# EAGLE design GM-UART-V2 (EAGLE 9.3.0)
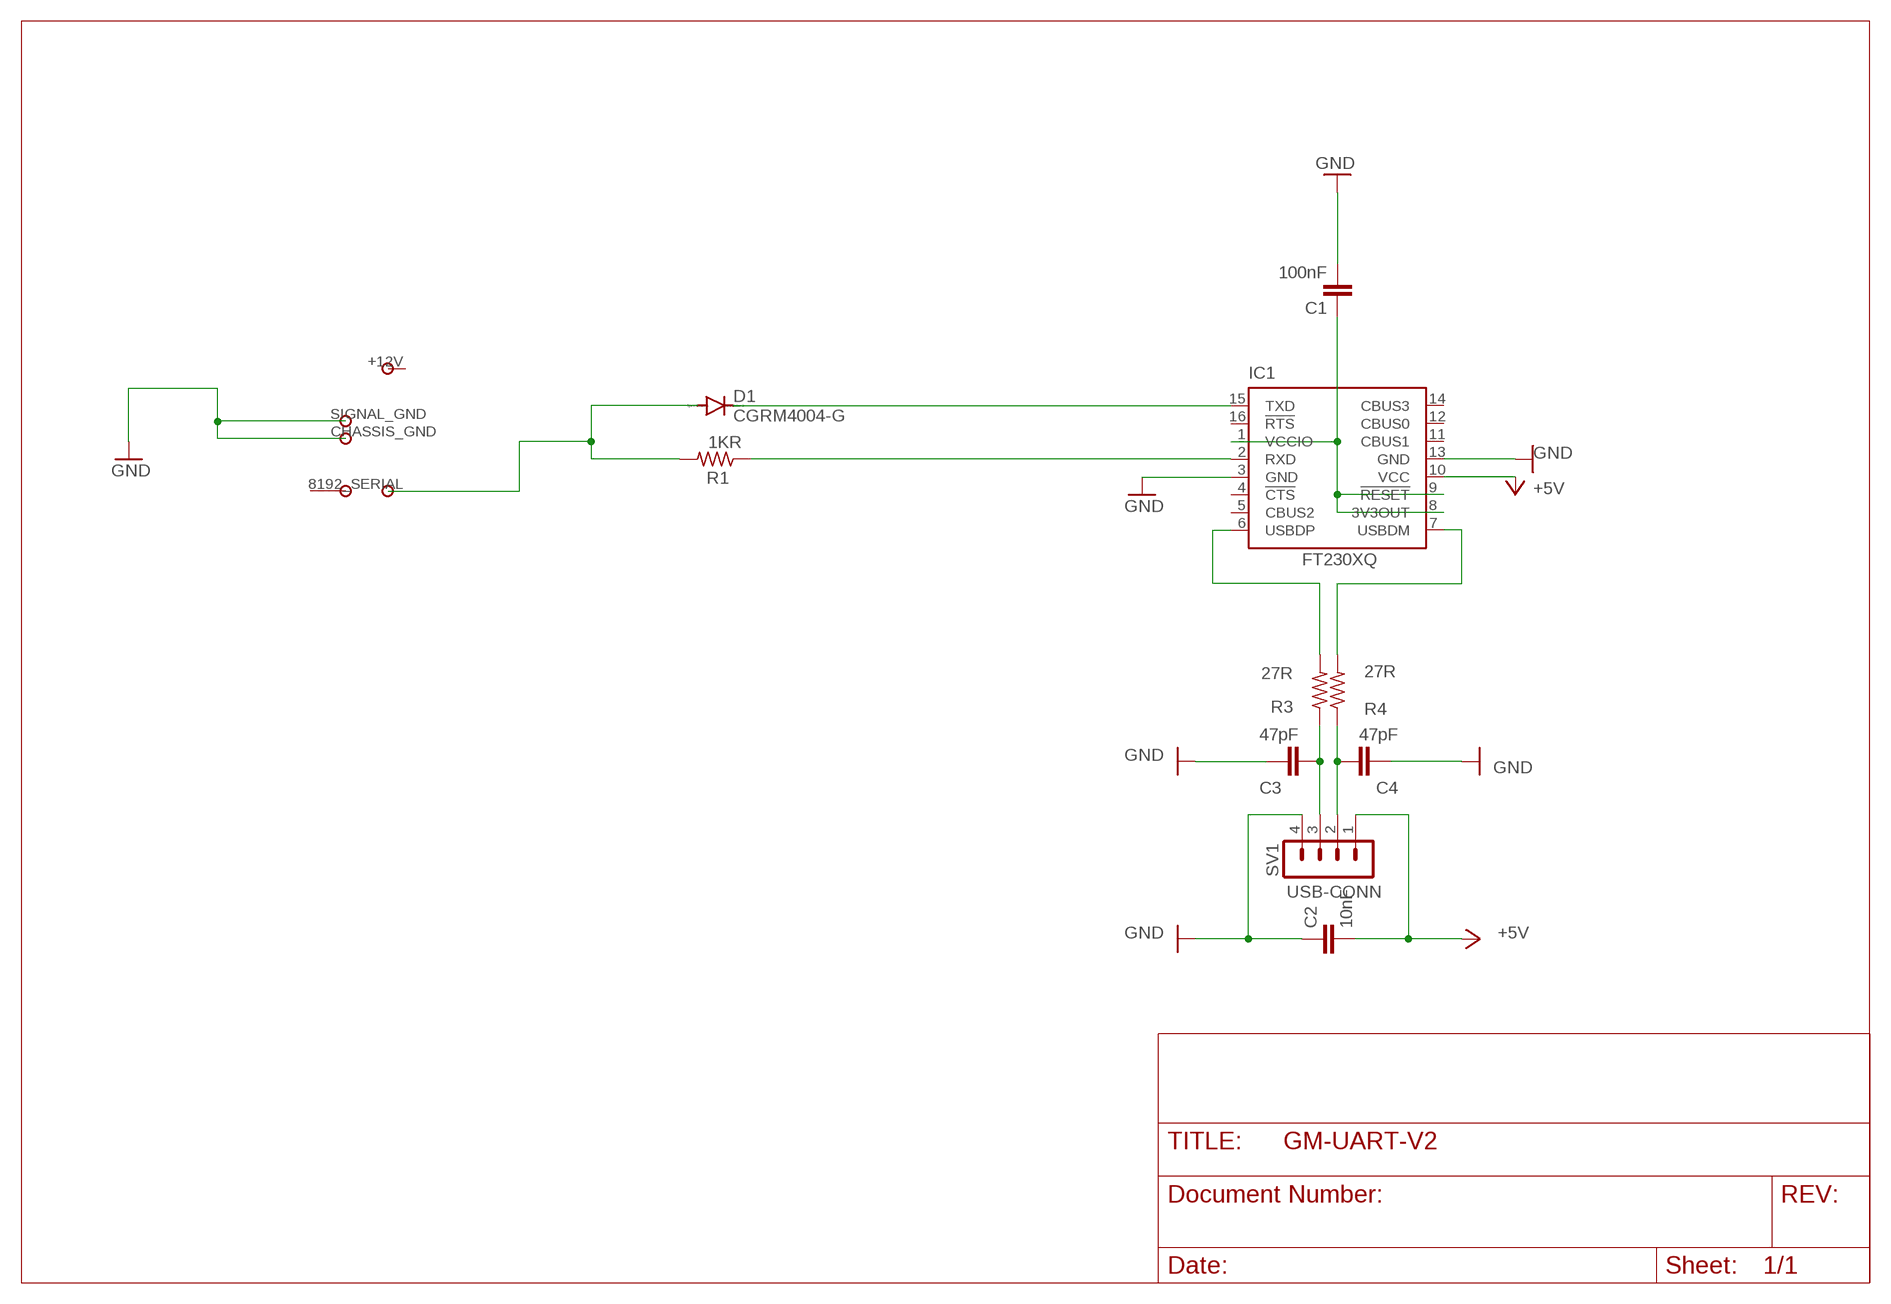
[diagram p0: schematic, sheet 1]

## Parts
C1  100nF  C-EUC0603K  [C0603K]
C2  10nF  C-EUC0603K  [C0603K]
C3  47pF  C-EUC0603K  [C0603K]
C4  47pF  C-EUC0603K  [C0603K]
D1  CGRM4004-G  [SOD-123_MINI-SMA]
IC1  FT230XQ  [QFN16]
R1  1KR  R-US_M0805  [M0805]
R3  27R  R-US_R0603  [R0603]
R4  27R  R-US_R0603  [R0603]
SV1  USB-CONN  MA04-1  [MA04-1]
U$2  OBD2PLUG  [OBD2PLUG]

## Nets
+5V: C2.2 IC1.10(VCC) SV1.1
GM-UART: D1.A R1.2 U$2.8192_SERIAL
GND: C1.2 C2.1 C3.2 C4.2 IC1.3(GND) IC1.13(GND) SV1.4 U$2.CHASSIS_GND U$2.SIGNAL_GND
N$1: C1.1 IC1.1(VCCIO) IC1.8(3V3OUT) IC1.9(!RESET)
N$2: C3.1 R3.1 SV1.3
N$3: C4.1 R4.1 SV1.2
N$4: IC1.7(USBDM) R4.2
N$5: IC1.6(USBDP) R3.2
RXD: IC1.2(RXD) R1.1
TXD: D1.C IC1.15(TXD)
Unconnected: IC1.4(!CTS) IC1.5(CBUS2) IC1.11(CBUS1) IC1.12(CBUS0) IC1.14(CBUS3) IC1.16(!RTS) U$2.P$1

## Power pins joined to a net without a drawn wire
+12V: U$2.+12V

## Library data of the parts
C1-C4 = rcl:C-EU: CAPACITOR, European symbol; SPICEPREFIX: C
D1 = diode:CGRM400*-G: Molded plasitc,JEDEC SOD-123/Mini SMA Source: Comchip CGRM4001-G.pdf
IC1 = ftdichip:FT230X: USB to BASIC UART IC Auto generated by make-symbol-device-package-bsdl.ulp Rev. 43 Source: Data sheet <http://www.ftdichip.com/Support/Documents/DataSheets/ICs/DS_FT230X.pdf>
R1 R3 R4 = rcl:R-US_: RESISTOR, American symbol; SPICEPREFIX: R
SV1 = con-lstb:MA04-1: PIN HEADER; OC_FARNELL: unknown; OC_NEWARK: unknown
U$2 = OBD2PLUG - Copy:OBD2PLUG

## Board
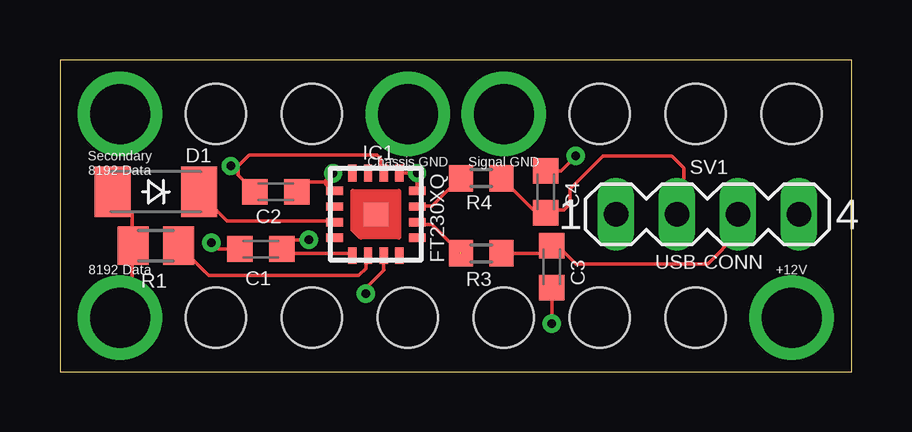
[diagram p1: board, top side]
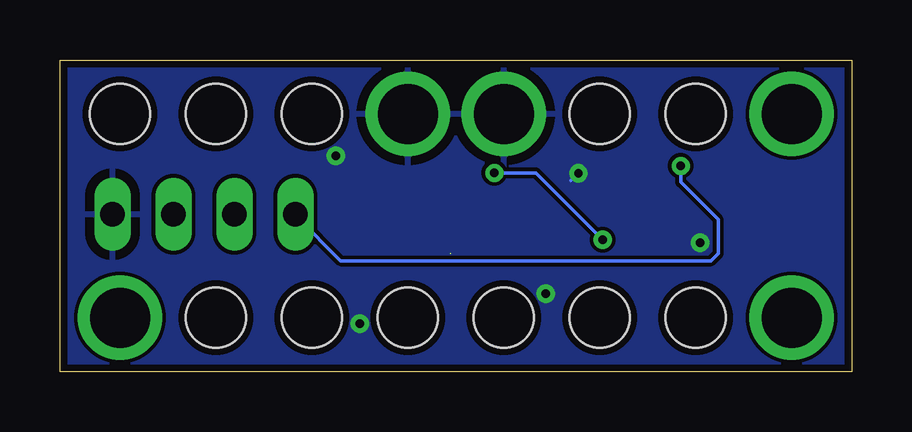
[diagram p2: board, bottom side, seen from below]

Size 33 x 13 mm. Coordinates in mm from the lower left corner, seen from the top.
Outline: 0,0 33,0 33,13 0,13 0,0
Copper layers (1*16): Top 0.035mm / dielectric 1.5mm / Bottom 0.035mm
Design rules "default *": minimum track width 6mil, minimum drill 0.35mm, track to track 6mil, track to pad 10mil, pad to pad 6mil, via to via 6mil, smd to smd 6mil, copper to edge 12mil, drill to drill 12mil, minimum pad ring 10mil, minimum via ring 8mil, stop-mask expansion 4mil, vias tented up to drill 0mil, thermal gap 15mil

### Footprints (pad centres in the part's own frame; a part is rotated, then mirrored left to right if it is on the bottom)
C0603K = smd 1.05 x 1.08: 1 -0.875,0; 2 0.875,0
SOD-123_MINI-SMA = smd 1.5 x 2.1: A 1.8,0; C -1.8,0
QFN16 = smd 0.7 x 0.35: 1 -1.725,0.975; 2 -1.725,0.325; 3 -1.725,-0.325; 4 -1.725,-0.975; 9 1.725,-0.975; 10 1.725,-0.325; 11 1.725,0.325; 12 1.725,0.975 | smd 0.35 x 0.7: 5 -0.975,-1.725; 6 -0.325,-1.725; 7 0.325,-1.725; 8 0.975,-1.725; 13 0.975,1.725; 14 0.325,1.725; 15 -0.325,1.725; 16 -0.975,1.725 | smd 1 x 1: TAB 0,0
M0805 = smd 1.3 x 1.6: 1 -0.95,0; 2 0.95,0
R0603 = smd 1 x 1.1: 1 -0.85,0; 2 0.85,0
MA04-1 = drill 1.016 long: 1 -3.81,0; 2 -1.27,0; 3 1.27,0; 4 3.81,0
OBD2PLUG = drill 2.5 pad 3: 8192_SERIAL 0,0; +12V 28,0; CHASSIS_GND 12,8.5; P$1 0,8.5; SIGNAL_GND 16,8.5 | hole 2.5: 4,8.5; 8,8.5; 20,8.5; 24,8.5; 28,8.5; 24,0; 20,0; 16,0; 12,0; 8,0; 4,0

### Placement (x,y rotation side)
C1  8.38,5.11 180 top
C2  9,7.5 180 top
C3  20.5,4.38 270 top
C4  20.25,7.5 90 top
D1  4,7.5 180 top
IC1  13.17,6.56 90 top
R1  4,5.25 180 top
R3  17.56,4.93 180 top
R4  17.56,8.07 180 top
SV1  27,6.56 0 top
U$2  2.5,2.25 0 top

### Tracks (layer width: path | path; a pad name or v marks a point on that pad's centre or on a via)
+5V  (via drill 0.35)
  Top 0.152: 7.42,8.58 7.88,9.03 13.22,9.03 13.37,8.88 13.37,8.43 IC1.10 | C2.2 7.42,8.2 7.42,8.58 | v7.12,8.58 7.42,8.58
  Bottom 0.152: v7.12,8.58 7.12,7.9 5.55,6.33 5.55,4.92 5.86,4.62 21.29,4.62 23.12,6.44 SV1.1
GM-UART
  Top 0.152: D1.A 2.24,7.36 3,6.6 3,5.38 R1.2 3,5.22 3,2.79 2.55,2.33 U$2.8192_SERIAL
GND  (via drill 0.35)
  Top 0.152: IC1.13 | 11.19,7.54 IC1.13 | IC1.13 11.5,7.48 | 11.42,7.52 IC1.13 | 13.52,4.77 IC1.3 13.49,4.25 13.5,4.25 12.75,3.5 v12.75,3.25 | 20.49,3.63 C3.2 v20.5,2 | C1.2 6.59,5.11 v6.32,5.38 | 20.24,8.52 C4.2 20.88,8.38 v21.5,9 | C2.1 10.28,7.9 11,7.9 | 11.06,7.94 v11.39,8.27 11.2,8.09 11.2,7.7 | 11.06,7.94 11.02,7.9 11,7.9 | 11,7.9 11.07,7.83 | 11.07,7.83 11.2,7.7 | 11.2,7.7 11.36,7.54 IC1.13 | 11.06,7.94 11.07,7.92 11.07,7.83
  Bottom 0.152: 14.44,10.71 U$2.CHASSIS_GND | 11.69,7.97 v11.39,8.27
  pour Bottom: 0,13 33,13 33,0 0,0
N$1  (via drill 0.35)
  Top 0.152: IC1.9 14.75,8.29 v14.89,8.29 14.89,8.16 IC1.8 | IC1.1 12.15,4.92 9.27,4.92 9.31,5.05 C1.1 9.64,5.5 v10.38,5.5
  Bottom 0.152: v10.38,5.5 13.16,8.29 v14.89,8.29
N$2
  Top 0.152: 20.65,5.31 C3.1 | 18.55,4.92 R3.1 20.18,4.93 C3.1 | 20.49,5.31 C3.1 | C3.1 20.75,5.25 21.5,4.5 27,4.5 28.27,5.76 SV1.3
N$3
  Top 0.152: 18.55,8.12 R4.1 19.86,6.62 C4.1 20.38,6.75 21,6.75 21.25,7 21.25,7.62 22.62,9 25.5,9 26,8.5 26,6.84 SV1.2
N$4
  Top 0.152: 16.71,7.94 R4.2 16.57,7.97 15.5,6.9 15.04,6.9 IC1.7
N$5  (1 unrouted)
  Top 0.152: 16.69,4.95 15.5,6.14 15.04,6.14 IC1.6
RXD
  Top 0.152: IC1.2 12.76,4.77 12.76,4.31 12.45,4 6.21,4 4.99,5.22 R1.1
TXD
  Top 0.152: IC1.15 11.39,6.29 6.97,6.29 5.9,7.36 D1.C